# Altium schematic sheet A6_dianshe2_yuanlitu.SchDoc
size A4
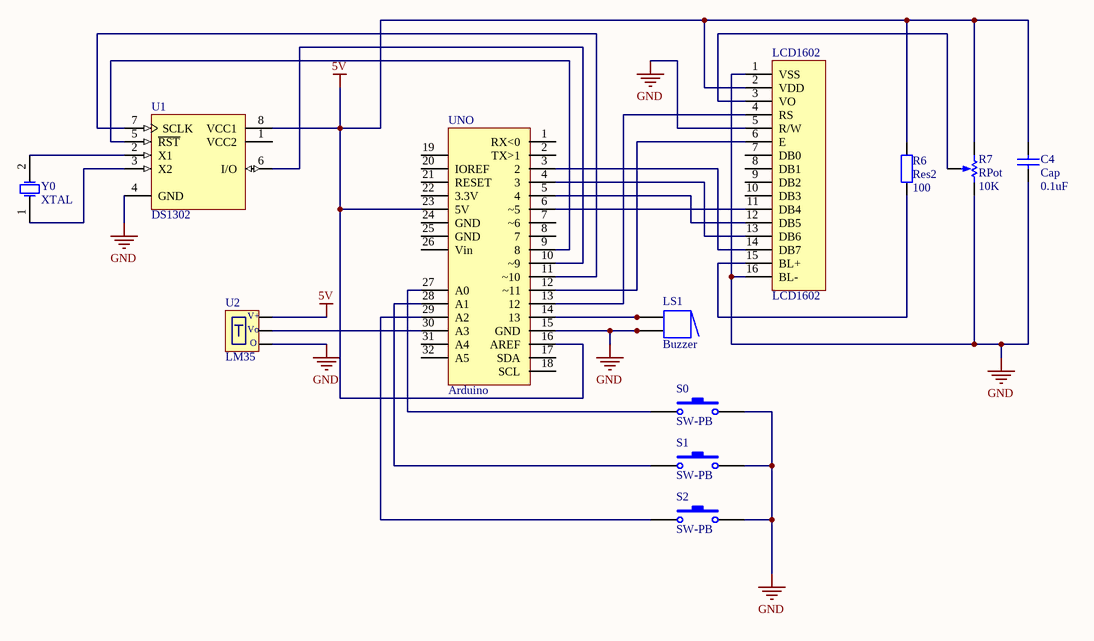
[diagram p0: A6_dianshe2_yuanlitu.SchDoc]

## Parts
C4  Cap  value 0.1uF  [RAD0.2]
LCD1602  LCD1602  [LCD1602]
LS1  Buzzer  [Buzzer]
R6  Res2  value 100  [AXIAL-0.4]
R7  RPot  value 10K  [VR5]
S0  SW-PB  [AN-S]
S1  SW-PB  [AN-S]
S2  SW-PB  [AN-S]
U1  DS1302  [DIP8]
U2  LM35  [LM35]
UNO  Arduino  [Arduino-UNO]
Y0  XTAL  [R38]

## Nets
5V: C4.2 LCD1602.2(VDD) R6.2 R7.1(TOP) U1.8(VCC1) U2.1 UNO.16(AREF) UNO.23(5V)
GND: C4.1 LCD1602.1(VSS) LCD1602.5(R/W) LCD1602.16(BL-) LS1.2 LS1.2A R7.3(BOT) S0.2 S1.2 S2.2 U1.4(GND) U2.3 UNO.15(GND)
NetLCD1602_3: LCD1602.3(VO) R7.2(TAP)
NetLCD1602_4: LCD1602.4(RS) UNO.13(12)
NetLCD1602_6: LCD1602.6(E) UNO.12(~11)
NetLCD1602_11: LCD1602.11(DB4) UNO.6(~5)
NetLCD1602_12: LCD1602.12(DB5) UNO.5(4)
NetLCD1602_13: LCD1602.13(DB6) UNO.4(3)
NetLCD1602_14: LCD1602.14(DB7) UNO.3(2)
NetLCD1602_15: LCD1602.15(BL+) R6.1
NetLS1_1: LS1.1 LS1.1A UNO.14(13)
NetS0_1: S0.1 UNO.27(A0)
NetS1_1: S1.1 UNO.28(A1)
NetS2_1: S2.1 UNO.29(A2)
NetU1_2: U1.2(X1) Y0.2(OSC2)
NetU1_3: U1.3(X2) Y0.1(OSC1)
NetU1_5: U1.5(~{RST}) UNO.9(8)
NetU1_6: U1.6(I/O) UNO.10(~9)
NetU1_7: U1.7(SCLK) UNO.11(~10)
NetU2_2: U2.2 UNO.30(A3)

Not connected (* = marked no-connect by the designer): LCD1602 7(DB0) 8(DB1) 9(DB2) 10(DB3); U1 1(VCC2); UNO 1(RX<0) 2(TX>1) 7(~6) 8(7) 17(SDA) 18(SCL) 19 20(IOREF) 21(RESET) 22(3.3V) 24(GND) 25(GND) 26(Vin) 31(A4) 32(A5)

## Notes on the sheet
- (in symbol LM35) V+; Vo; O

## Library data of the parts
C4 = Cap: Capacitor; Published: 8-Jun-2000; LatestRevisionDate: 17-Jul-2002; LatestRevisionNote: Re-released for DXP Platform.; PackageReference: RAD-0.3; Publisher: Altium Limited
LCD1602 = LCD1602: 液晶屏
LS1 = Buzzer: Magnetic Transducer Buzzer; Published: 24-Mar-1999; LatestRevisionDate: 17-Dec-2003; LatestRevisionNote: Schematic revised, PCB Footprint replaced.; DatasheetDocument: 17-Dec-2003; PackageReference: ABSM-1574; Publisher: Altium Limited; ComponentLink1Description: Manufacturer Link; ComponentLink1URL: http://www.megastar.com/linecard/buzzmode/index.php
R6 = Res2: Resistor; Published: 8-Jun-2000; LatestRevisionDate: 17-Jul-2002; LatestRevisionNote: Re-released for DXP Platform.; PackageReference: AXIAL-0.4; Publisher: Altium Limited
R7 = RPot: Potentiometer; Sim Note: Enter the Resistance value and the set point into parameter fields.; Set Position: 0.5; Published: 8-Jun-2000; LatestRevisionDate: 17-Jul-2002; LatestRevisionNote: Re-released for DXP Platform.; PackageReference: VR5; Publisher: Altium Limited
S0-S2 = SW-PB: Switch; Published: 24-Mar-1999; LatestRevisionDate: 17-Jul-2002; LatestRevisionNote: Re-released for DXP Platform.; PackageReference: SPST-2; Publisher: Altium Limited
U1 = DS1302: Trickle Charge Timekeeping Chip; Published: 13-Oct-2000; LatestRevisionDate: 06-Jun-2005; LatestRevisionNote: Stylized 3D Model Added.; DatasheetVersion: 2-Jul-1999; PackageVersion: 1999; PackageReference: DIP8; Publisher: Altium Limited; PackageDescription: DIP; 8 Leads; Row Spacing 7.62 mm; Pitch 2.54 mm; ComponentLink1Description: Manufacturer Link; ComponentLink1URL: http://www.maxim-ic.com/; ComponentLink2Description: Datasheet; ComponentLink2URL: http://pdfserv.maxim-ic.com/en/ds/DS1302.pdf
U2 = LM35: LM35温度传感器
UNO = Arduino-UNO
Y0 = XTAL: Crystal Oscillator; Published: 8-Jun-2000; LatestRevisionDate: 17-Jul-2002; LatestRevisionNote: Re-released for DXP Platform.; PackageReference: R38; Publisher: Altium Limited